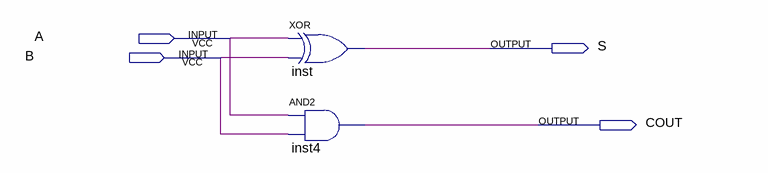
[diagram p0: schematic sheet]
// Quartus schematic nhan4bit_HA.bdf as structural Verilog: 2 symbols, 4 pins
module nhan4bit_HA (
  input  A,
  input  B,
  output S,
  output COUT
);

  xor inst (S, A, B);
  and inst4 (COUT, A, B);
endmodule
